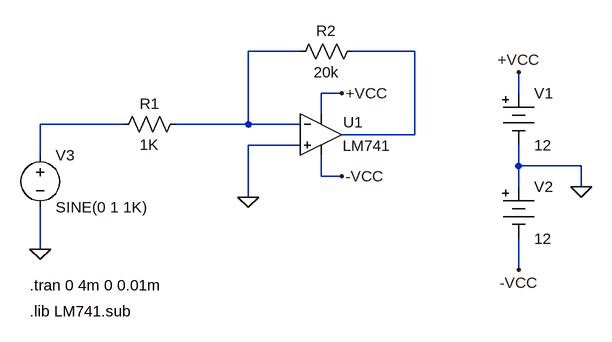
[diagram p0: schematic opamp_05_02_01_inv_tran.asc]
opamp_05_02_01_inv_tran.asc, the LTspice schematic file:
Version 4
SHEET 1 880 680
WIRE 16 -16 -64 -16
WIRE 192 -16 96 -16
WIRE 80 48 48 48
WIRE 352 48 352 16
WIRE 48 80 48 48
WIRE -256 96 -384 96
WIRE -64 96 -64 -16
WIRE -64 96 -176 96
WIRE 16 96 -64 96
WIRE 192 112 192 -16
WIRE 192 112 80 112
WIRE 16 128 -64 128
WIRE -384 144 -384 96
WIRE 352 160 352 128
WIRE 448 160 352 160
WIRE 48 176 48 144
WIRE 80 176 48 176
WIRE 352 192 352 160
WIRE 448 192 448 160
WIRE -64 208 -64 128
WIRE -384 288 -384 224
WIRE 352 320 352 272
FLAG 448 192 0
FLAG 352 16 +VCC
FLAG 352 320 -VCC
FLAG -64 208 0
FLAG -384 288 0
FLAG 80 48 +VCC
FLAG 80 176 -VCC
SYMBOL Misc\\battery 352 32 R0
WINDOW 123 0 0 Left 2
WINDOW 39 0 0 Left 2
SYMATTR InstName V1
SYMATTR Value 12
SYMBOL Misc\\battery 352 176 R0
WINDOW 123 0 0 Left 2
WINDOW 39 0 0 Left 2
SYMATTR InstName V2
SYMATTR Value 12
SYMBOL res -160 80 R90
WINDOW 0 0 56 VBottom 2
WINDOW 3 32 56 VTop 2
SYMATTR InstName R1
SYMATTR Value 1K
SYMBOL res 112 -32 R90
WINDOW 0 0 56 VBottom 2
WINDOW 3 32 56 VTop 2
SYMATTR InstName R2
SYMATTR Value 20k
SYMBOL voltage -384 128 R0
WINDOW 123 0 0 Left 2
WINDOW 39 0 0 Left 2
SYMATTR InstName V3
SYMATTR Value SINE(0 1 1K)
SYMBOL Opamps\\opamp2 48 48 R0
WINDOW 0 34 45 Left 2
WINDOW 3 33 81 Left 2
SYMATTR InstName U1
SYMATTR Value LM741
TEXT -400 344 Left 2 !.tran 0 4m 0 0.01m
TEXT -400 384 Left 2 !.lib LM741.sub

The netlist it stands for:
* opamp_05_02_01_inv_tran.asc
V1 +VCC 0 12
V2 0 -VCC 12
R1 N001 N003 1K
R2 N002 N001 20k
V3 N003 0 SINE(0 1 1K)
XU1 0 N001 +VCC -VCC N002 LM741  ; pins In+ In- V+ V- OUT
.tran 0 4m 0 0.01m
.lib LM741.sub
.backanno
.end